# Altium schematic sheet RS485_Xbus_Mini.SchDoc
size A0
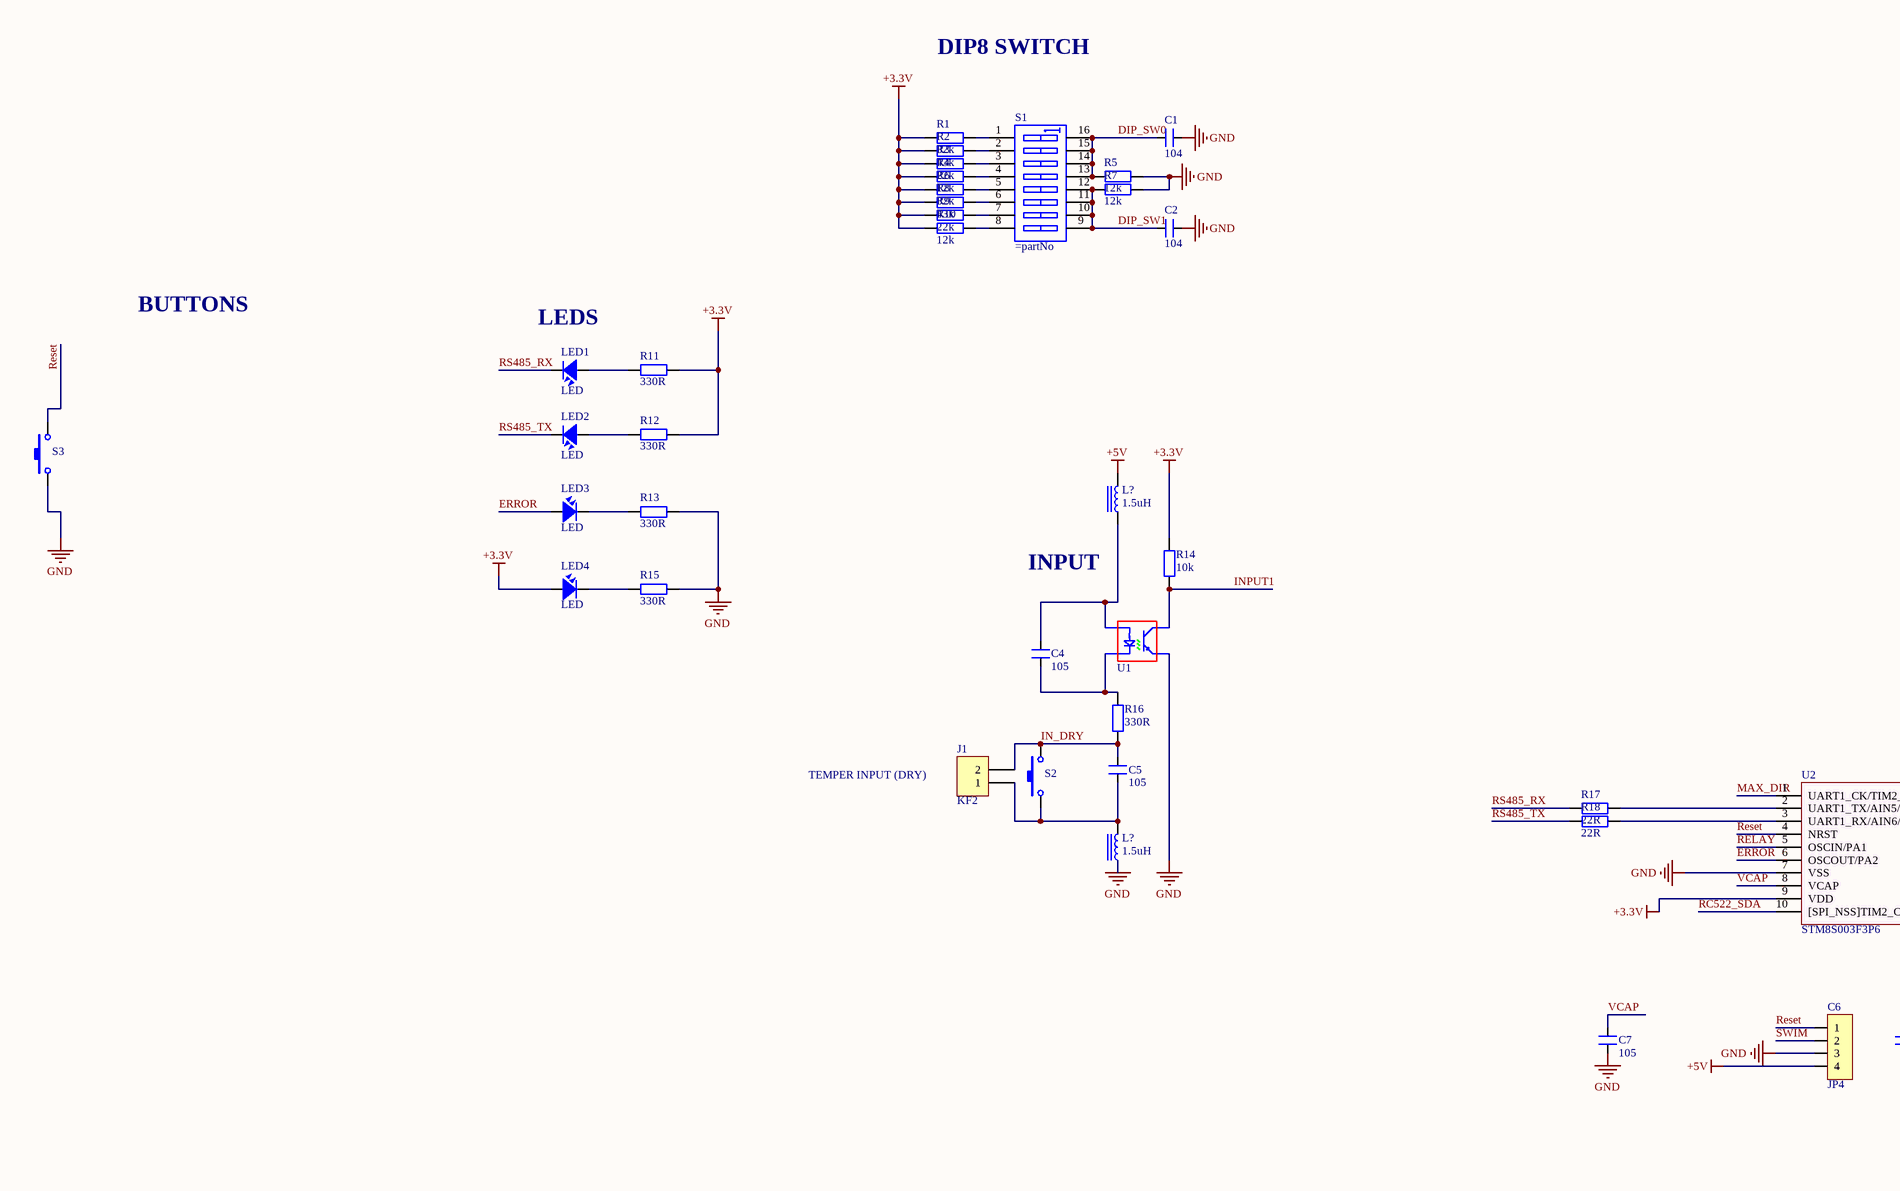
[diagram p0: RS485_Xbus_Mini.SchDoc, left]
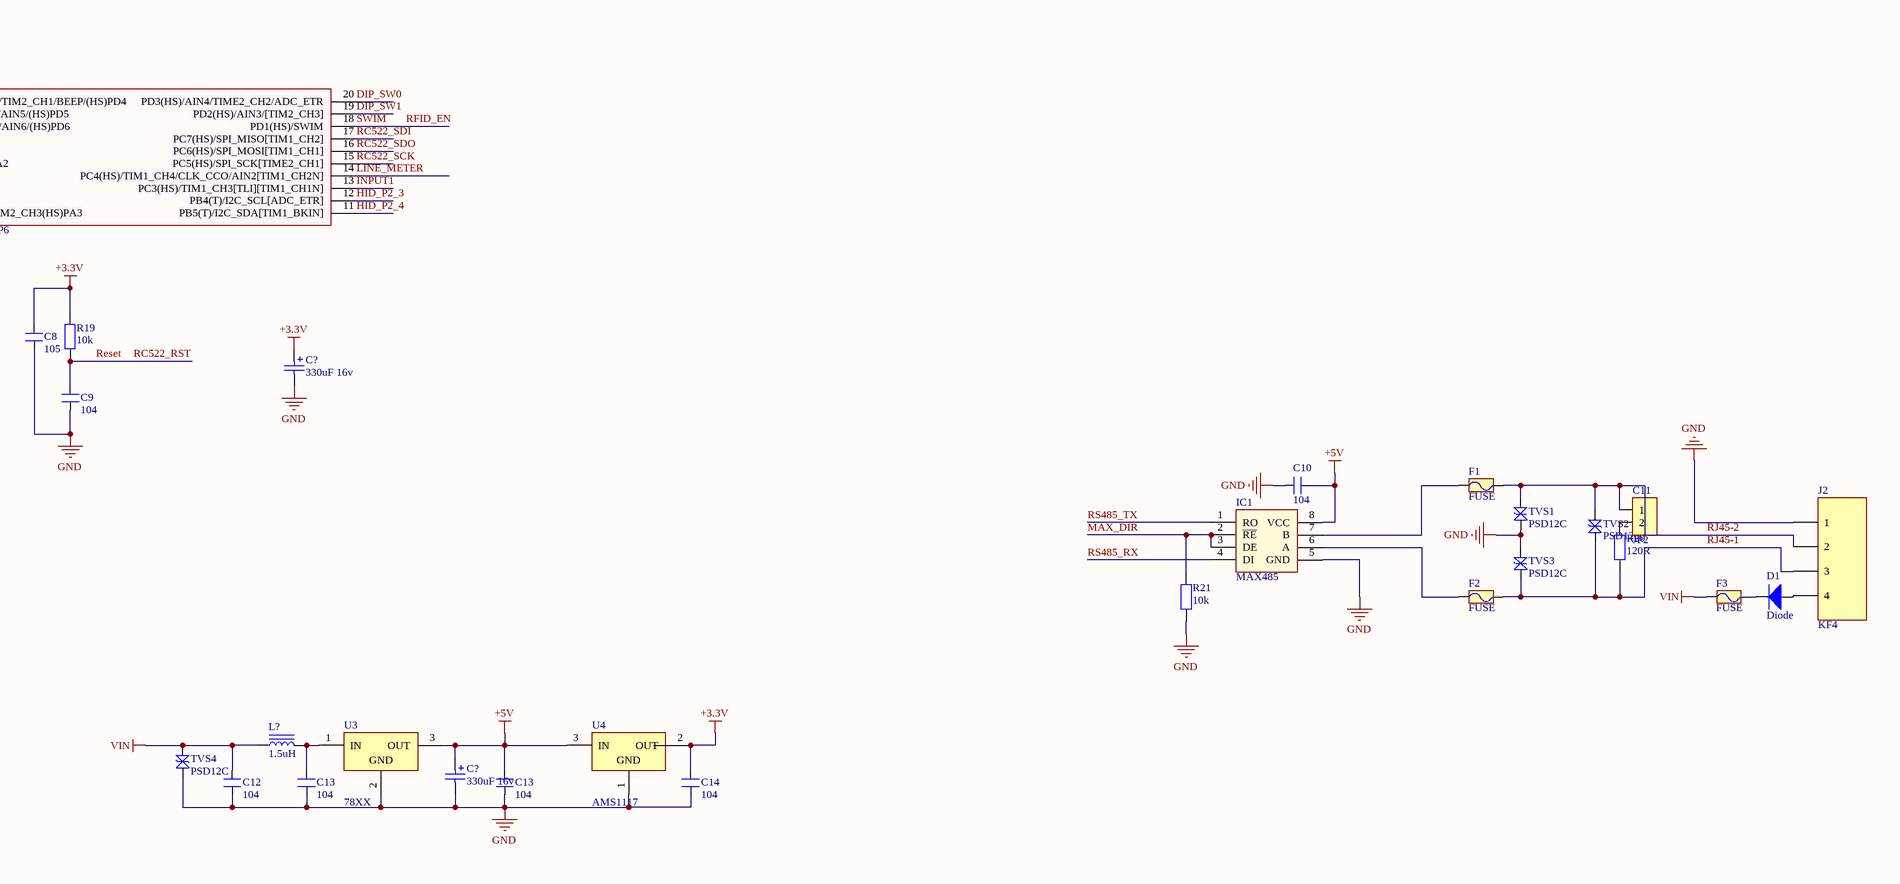
[diagram p1: RS485_Xbus_Mini.SchDoc, right]

## Parts
(Parts that share a designator on the sheet are numbered #1, #2 ... from top to bottom, then left to right.)
C1  104  [SM-0805]
C2  104  [SM-0805]
C4  105  [SM-0805]
C5  105  [SM-0805]
C6  JP4  [JP4-C1T]
C7  105  [SM-0805]
C8  105  [SM-0805]
C9  104  [SM-0805]
C10  104  [SM-0805]
C11  JP2  [JP2-D1T]
C12  104  [SM-0805]
C13#1  104  [SM-0805]
C13#2  104  [SM-0805]
C14  104  [SM-0805]
C?#1  330uF 16v  [WCAP-AS5H_8x10.5]
C?#2  330uF 16v  [WCAP-AS5H_8x10.5]
D1  Diode  [DIO-SMD-106]
F1  FUSE  [RES-SMD-1812]
F2  FUSE  [RES-SMD-1812]
F3  FUSE  [RES-SMD-1812]
IC1  MAX485  [SO-8]
J1  KF2  [KF2-5.08]
J2  KF4  [KF4-5.08]
L?#1  1.5uH  [FER 0805/2012]
L?#2  1.5uH  [FER 0805/2012]
L?#3  1.5uH  [FER 0805/2012]
LED1  LED  [SM-LED-0805-Green]
LED2  LED  [SM-LED-0805-Blue]
LED3  LED  [SM-LED-0805-Red]
LED4  LED  [SM-LED-0805-Red]
R1  82k  [RES-SMD-0805]
R2  43k  [RES-SMD-0805]
R3  22k  [RES-SMD-0805]
R4  12k  [RES-SMD-0805]
R5  12k  [RES-SMD-0805]
R6  82k  [RES-SMD-0805]
R7  12k  [RES-SMD-0805]
R8  43k  [RES-SMD-0805]
R9  22k  [RES-SMD-0805]
R10  12k  [RES-SMD-0805]
R11  330R  [RES-SMD-0805]
R12  330R  [RES-SMD-0805]
R13  330R  [RES-SMD-0805]
R14  10k  [RES-SMD-0805]
R15  330R  [RES-SMD-0805]
R16  330R  [RES-SMD-0805]
R17  22R  [RES-SMD-0805]
R18  22R  [RES-SMD-0805]
R19  10k  [RES-SMD-0805]
R20  120R  [RES-SMD-0805]
R21  10k  [RES-SMD-0805]
S1  (no value)  [SW-DIP8]
S2  SW  [BUTTON-SMD 2PIN]  (value not drawn)
S3  SW  [BUTTON-SMD 2PIN]  (value not drawn)
TVS1  PSD12C  [DIO-SMD-123]
TVS2  PSD12C  [DIO-SMD-123]
TVS3  PSD12C  [DIO-SMD-123]
TVS4  PSD12C  [DIO-SMD-B]
U1  EL3H7 Opto  [SSOP4]  (value not drawn)
U2  STM8S003F3P6  [TSOP20]
U3  78XX  [SOT-89-321]
U4  AMS1117  [SOT223]

## Nets
+3.3V: C8.2 C14.2 C?#1.1(P) LED4.1 R1.2 R2.2 R3.2 R4.2 R6.2 R8.2 R9.2 R10.2 R11.1 R12.1 R14.2 R19.2 U2.9(VDD) U4.2(OUT) U4.4
+5V: C6.4 C10.1 C13#2.2 C?#2.1(P) IC1.8(VCC) L?#1.2 U3.3(OUT) U4.3(IN)
GND: C1.1 C2.1 C6.3 C7.1 C8.1 C9.1 C10.2 C12.1 C13#1.1 C13#2.1 C14.1 C?#1.2(N) C?#2.2(N) IC1.5(GND) J2.1 L?#2.1 R5.1 R7.1 R13.1 R15.1 R21.2 S3.1 TVS1.1 TVS3.2 TVS4.1 U1.3 U2.7(VSS) U3.2(GND) U4.1(GND)
VIN: C12.2 F3.1 L?#3.1 TVS4.2
DIP_SW0: C1.2 R5.2 S1.13 S1.14 S1.15 S1.16 U2.20(PD3(HS)/AIN4/TIME2_CH2/ADC_ETR)
DIP_SW1: C2.2 R7.2 S1.9 S1.10 S1.11 S1.12 U2.19(PD2(HS)/AIN3/[TIM2_CH3])
ERROR: LED3.1 U2.6(OSCOUT/PA2)
HID_P2_3: U2.12(PB4(T)/I2C_SCL[ADC_ETR])
HID_P2_4: U2.11(PB5(T)/I2C_SDA[TIM1_BKIN])
IN_DRY: C5.2 J1.2 R16.1 S2.2
INPUT1: R14.1 U1.4 U2.13(PC3(HS)/TIM1_CH3[TLI][TIM1_CH1N])
LINE_METER: U2.14(PC4(HS)/TIM1_CH4/CLK_CCO/AIN2[TIM1_CH2N])
MAX_DIR: IC1.2(~{RE}) IC1.3(DE) R21.1 U2.1(UART1_CK/TIM2_CH1/BEEP/(HS)PD4)
RC522_RST: C6.1 C9.2 R19.1 S3.2 U2.4(NRST)  [also labelled Reset]
RC522_SCK: U2.15(PC5(HS)/SPI_SCK[TIME2_CH1])
RC522_SDA: U2.10([SPI_NSS]TIM2_CH3(HS)PA3)
RC522_SDI: U2.17(PC7(HS)/SPI_MISO[TIM1_CH2])
RC522_SDO: U2.16(PC6(HS)/SPI_MOSI[TIM1_CH1])
RELAY: U2.5(OSCIN/PA1)
RFID_EN: C6.2 U2.18(PD1(HS)/SWIM)  [also labelled SWIM]
RJ45-1: F2.2 J2.3 R20.2 TVS2.1 TVS3.1
RJ45-2: C11.1 F1.2 J2.2 TVS1.2 TVS2.2
RS485_RX: IC1.4(DI) LED1.2 R17.2
RS485_TX: IC1.1(RO) LED2.2 R18.2
VCAP: C7.2 U2.8(VCAP)
NetC4_1: C4.1 R16.2 U1.2
NetC4_2: C4.2 L?#1.1 U1.1
NetC5_1: C5.1 J1.1 L?#2.2 S2.1
NetC11_2: C11.2 R20.1
NetC13#1_2: C13#1.2 L?#3.2 U3.1(IN)
NetD1_1: D1.1 J2.4
NetD1_2: D1.2 F3.2
NetF1_1: F1.1 IC1.7(B)
NetF2_1: F2.1 IC1.6(A)
NetLED1_1: LED1.1 R11.2
NetLED2_1: LED2.1 R12.2
NetLED3_2: LED3.2 R13.2
NetLED4_2: LED4.2 R15.2
NetR1_1: R1.1 S1.1
NetR2_1: R2.1 S1.2
NetR3_1: R3.1 S1.3
NetR4_1: R4.1 S1.4
NetR6_1: R6.1 S1.5
NetR8_1: R8.1 S1.6
NetR9_1: R9.1 S1.7
NetR10_1: R10.1 S1.8
NetR17_1: R17.1 U2.2(UART1_TX/AIN5/(HS)PD5)
NetR18_1: R18.1 U2.3(UART1_RX/AIN6/(HS)PD6)

## Notes on the sheet
- DIP8 SWITCH
- BUTTONS
- (near LED1) LEDS
- INPUT
- TEMPER INPUT (DRY)

## Library data of the parts
C1 C2 C4 C5 C7-C10 C12 C13#1 C13#2 C14 = CM: Cap SMD; Value: 103
C6 = JP4: WR-PHD 2.54 mm Angled Socket Header; Manufacturer: W¨¹rth Elektronik eiSos GmbH; partNo: 613004143121; ComponentLink1 Description: Manufacturer; ComponentLink2 Description: Datasheet; NoPins: 04; Created Date: 29 March 2013; ComponentLink1URL: http://www.we-online.com; ComponentLink2URL: http://katalog.we-online.de/em/datasheet/6130xx143121.pdf; Created by: Karrer Zheng
C11 = JP2: WR-PHD 2.54 mm Angled Socket Header; Manufacturer: W¨¹rth Elektronik eiSos GmbH; partNo: 613002143121; ComponentLink1 Description: Manufacturer; ComponentLink2 Description: Datasheet; NoPins: 02; Created Date: 29 March 2013; ComponentLink1URL: http://www.we-online.com; ComponentLink2URL: http://katalog.we-online.de/em/datasheet/6130xx143121.pdf; Created by: Karrer Zheng
C?#1 C?#2 = CAP/330uF/6.3V/865230153006: https://banlinhkien.vn/goods-2220-tu-nhom-330uf-16v-8x10mm.html; RatedVoltage: 6.3V; PublishedDate: July 2016; Publisher: Wurth Elektronik; ComponentLink1Description: Manufacturer; ComponentLink1URL: http://www.we-online.de; ComponentLink2Description: Datasheet; ComponentLink2URL: http://katalog.we-online.com/pbs/datasheet/865230153006.pdf; PartNumber: 865230153006; Value: 330uF; Size: 8mmx10.5mm
IC1 = MAX485: RS232 - RS485 (Same sn75176)
J1 = KF2: Manufacturer: Würth Elektronik eiSos GmbH; partNo: 691103110002; ComponentLink1 Description: Manufacturer; ComponentLink2 Description: Datasheet; NoPins: 2; Created Date: 29 October 2013; ComponentLink1URL: http://www.we-online.com; ComponentLink2URL: http://katalog.we-online.de/em/datasheet/6911031100xx.pdf; Created by: Karrer Zheng
J2 = KF4: Manufacturer: W¨¹rth Elektronik eiSos GmbH; PartNo: 691133710004; ComponentLink1 Description: Manufacturer; ComponentLink2 Description: Datasheet; NoPins: 4; ComponentLink1 URL: http://www.we-online.com; ComponentLink2 URL: http://katalog.we-online.de/em/datasheet/6911337100xx.pdf; Created By: Baojun Chen; Created Date: 4-Aug-15
L?#1-L?#3 = Inductor: SMT Inductor; Value: 1.5uH
R1-R21 = R: Resistor R1/4W
S1 = SWDIP8: WS-DITV 2.54 mm small compact THT flat actuator with top tape; Manufacturer: Wurth Elektronik; Part No.: 418127160908; ComponentLink1 Description: Manufacturer; ComponentLink2 Description: Datasheet; Pole: 08; Created Date: Dec.2015; ComponentLink1URL: http://www.we-online.com; ComponentLink2URL: http://katalog.we-online.de/em/datasheet/4181271609xx.pdf; Created by: Baojun Chen
S2 S3 = SW-Button: Switch-Button; Published: 24-Mar-1999; LatestRevisionDate: 17-Jul-2002; LatestRevisionNote: Re-released for DXP Platform.; PackageReference: SPST-2; Publisher: Altium Limited
TVS1-TVS4 = Diode TVS
U2 = STM8S003F3P6: MCU 8BIT 8KB FLASH TSSOP20
U3 = LM78XX
U4 = AMS117